# EAGLE schematic huzzah32_driver (EAGLE 8.4.1)
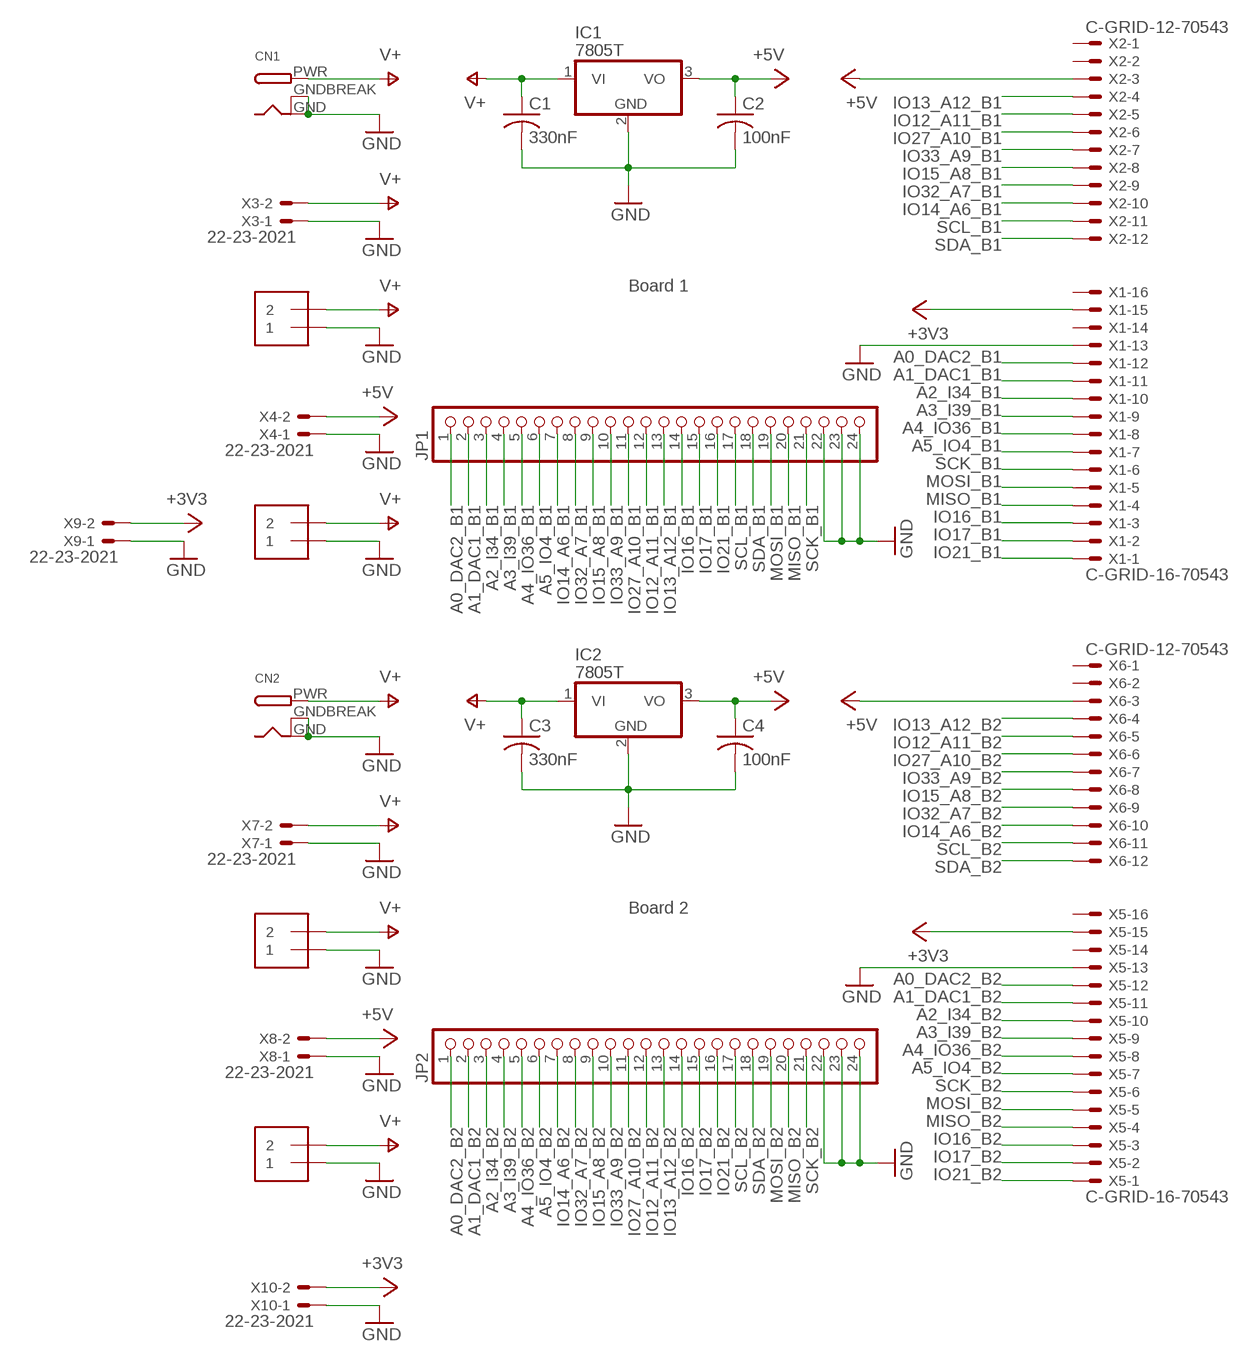
[diagram p0: schematic, sheet 1]

## Parts
C1  330nF  C-US050-035X075  [C050-035X075]
C2  100nF  C-US050-035X075  [C050-035X075]
C3  330nF  C-US050-035X075  [C050-035X075]
C4  100nF  C-US050-035X075  [C050-035X075]
CN1  DCBARRELPTH  [DCJACK_2MM_PTH]
CN2  DCBARRELPTH  [DCJACK_2MM_PTH]
IC1  7805T  [TO220H]
IC2  7805T  [TO220H]
J1  1X2-3.5MM  [1X2-3.5MM]
J2  1X2-3.5MM  [1X2-3.5MM]
J3  1X2-3.5MM  [1X2-3.5MM]
J4  1X2-3.5MM  [1X2-3.5MM]
JP1  PINHD-1X24  [1X24]
JP2  PINHD-1X24  [1X24]
X1  C-GRID-16-70543  [70543-16]
X2  C-GRID-12-70543  [70543-12]
X3  22-23-2021  [22-23-2021]
X4  22-23-2021  [22-23-2021]
X5  C-GRID-16-70543  [70543-16]
X6  C-GRID-12-70543  [70543-12]
X7  22-23-2021  [22-23-2021]
X8  22-23-2021  [22-23-2021]
X9  22-23-2021  [22-23-2021]
X10  22-23-2021  [22-23-2021]

## Nets
+3V3: X1.15 X5.15 X9.2 X10.2
+5V: C2.1 C4.1 IC1.3(VO) IC2.3(VO) X2.3 X4.2 X6.3 X8.2
A0_DAC2_B1: JP1.1 X1.12
A0_DAC2_B2: JP2.1 X5.12
A1_DAC1_B1: JP1.2 X1.11
A1_DAC1_B2: JP2.2 X5.11
A2_I34_B1: JP1.3 X1.10
A2_I34_B2: JP2.3 X5.10
A3_I39_B1: JP1.4 X1.9
A3_I39_B2: JP2.4 X5.9
A4_IO36_B1: JP1.5 X1.8
A4_IO36_B2: JP2.5 X5.8
A5_IO4_B1: JP1.6 X1.7
A5_IO4_B2: JP2.6 X5.7
GND: C1.2 C2.2 C3.2 C4.2 CN1.GND CN1.GNDBREAK CN2.GND CN2.GNDBREAK IC1.2(GND) IC2.2(GND) J1.1 J2.1 J3.1 J4.1 JP1.22 JP1.23 JP1.24 JP2.22 JP2.23 JP2.24 X1.13 X3.1 X4.1 X5.13 X7.1 X8.1 X9.1 X10.1
IO12_A11_B1: JP1.12 X2.5
IO12_A11_B2: JP2.12 X6.5
IO13_A12_B1: JP1.13 X2.4
IO13_A12_B2: JP2.13 X6.4
IO14_A6_B1: JP1.7 X2.10
IO14_A6_B2: JP2.7 X6.10
IO15_A8_B1: JP1.9 X2.8
IO15_A8_B2: JP2.9 X6.8
IO16_B1: JP1.14 X1.3
IO16_B2: JP2.14 X5.3
IO17_B1: JP1.15 X1.2
IO17_B2: JP2.15 X5.2
IO21_B1: JP1.16 X1.1
IO21_B2: JP2.16 X5.1
IO27_A10_B1: JP1.11 X2.6
IO27_A10_B2: JP2.11 X6.6
IO32_A7_B1: JP1.8 X2.9
IO32_A7_B2: JP2.8 X6.9
IO33_A9_B1: JP1.10 X2.7
IO33_A9_B2: JP2.10 X6.7
MISO_B1: JP1.20 X1.4
MISO_B2: JP2.20 X5.4
MOSI_B1: JP1.19 X1.5
MOSI_B2: JP2.19 X5.5
SCK_B1: JP1.21 X1.6
SCK_B2: JP2.21 X5.6
SCL_B1: JP1.17 X2.11
SCL_B2: JP2.17 X6.11
SDA_B1: JP1.18 X2.12
SDA_B2: JP2.18 X6.12
V+: C1.1 C3.1 CN1.PWR CN2.PWR IC1.1(VI) IC2.1(VI) J1.2 J2.2 J3.2 J4.2 X3.2 X7.2
Unconnected: X1.14 X1.16 X2.1 X2.2 X5.14 X5.16 X6.1 X6.2

## Notes on the sheet
- Board 1
- Board 2

## Library data of the parts
C1-C4 = resistor:C-US: CAPACITOR, American symbol
CN1 CN2 = adafruit:DCBARREL: 2.0mm DC Barrel Jack DCJACK_2MM_PTH - Through Hole Jack (4UConnector: 05537)
IC1 IC2 = linear:78*: Positive VOLTAGE REGULATOR Source: http://cache.national.com/ds/LM/LM78L05.pdf http://www.fairchildsemi.com/ds/LM/LM7805.pdf
J1-J4 = adafruit:1X2: 3.5mm Terminal block http://www.ladyada.net/library/pcb/eaglelibrary.html
JP1 JP2 = pinhead:PINHD-1X24: PIN HEADER
X1 X5 = lumiled_boards:C-GRID-16: CONNECTOR wire to board 2.54 mm (0.100") pitch header; OC_FARNELL: unknown; OC_NEWARK: unknown
X2 X6 = lumiled_boards:C-GRID-12: CONNECTOR wire to board 2.54 mm (0.100") pitch header; OC_FARNELL: unknown; OC_NEWARK: unknown
X3 X4 X7-X10 = con-molex:22-23-2021: .100" (2.54mm) Center Header - 2 Pin; MF: MOLEX; MPN: 22-23-2021; OC_FARNELL: 1462926; OC_NEWARK: 25C3832